# Altium schematic sheet Mikrokrmilnik, RF-detektor.SchDoc
size A4; CheckedBy: Nejc Klanjšček, Samo Penič; Author: Nejc Klanjšček; DrawnBy: Nejc Klanjšček; Engineer: Nejc Klanjšček; Organization: Fakulteta za elektrotehniko; Address1: https://github.com/nejcKlanjscek/SummerCampOfInnovativeTechnologies.git; Address2: nejc.kla@gmail.com; Revision: 1.0; SheetNumber: 1; SheetTotal: 2; Project: Poletni tabor inovativnih tehnologij 2021; License: MIT License
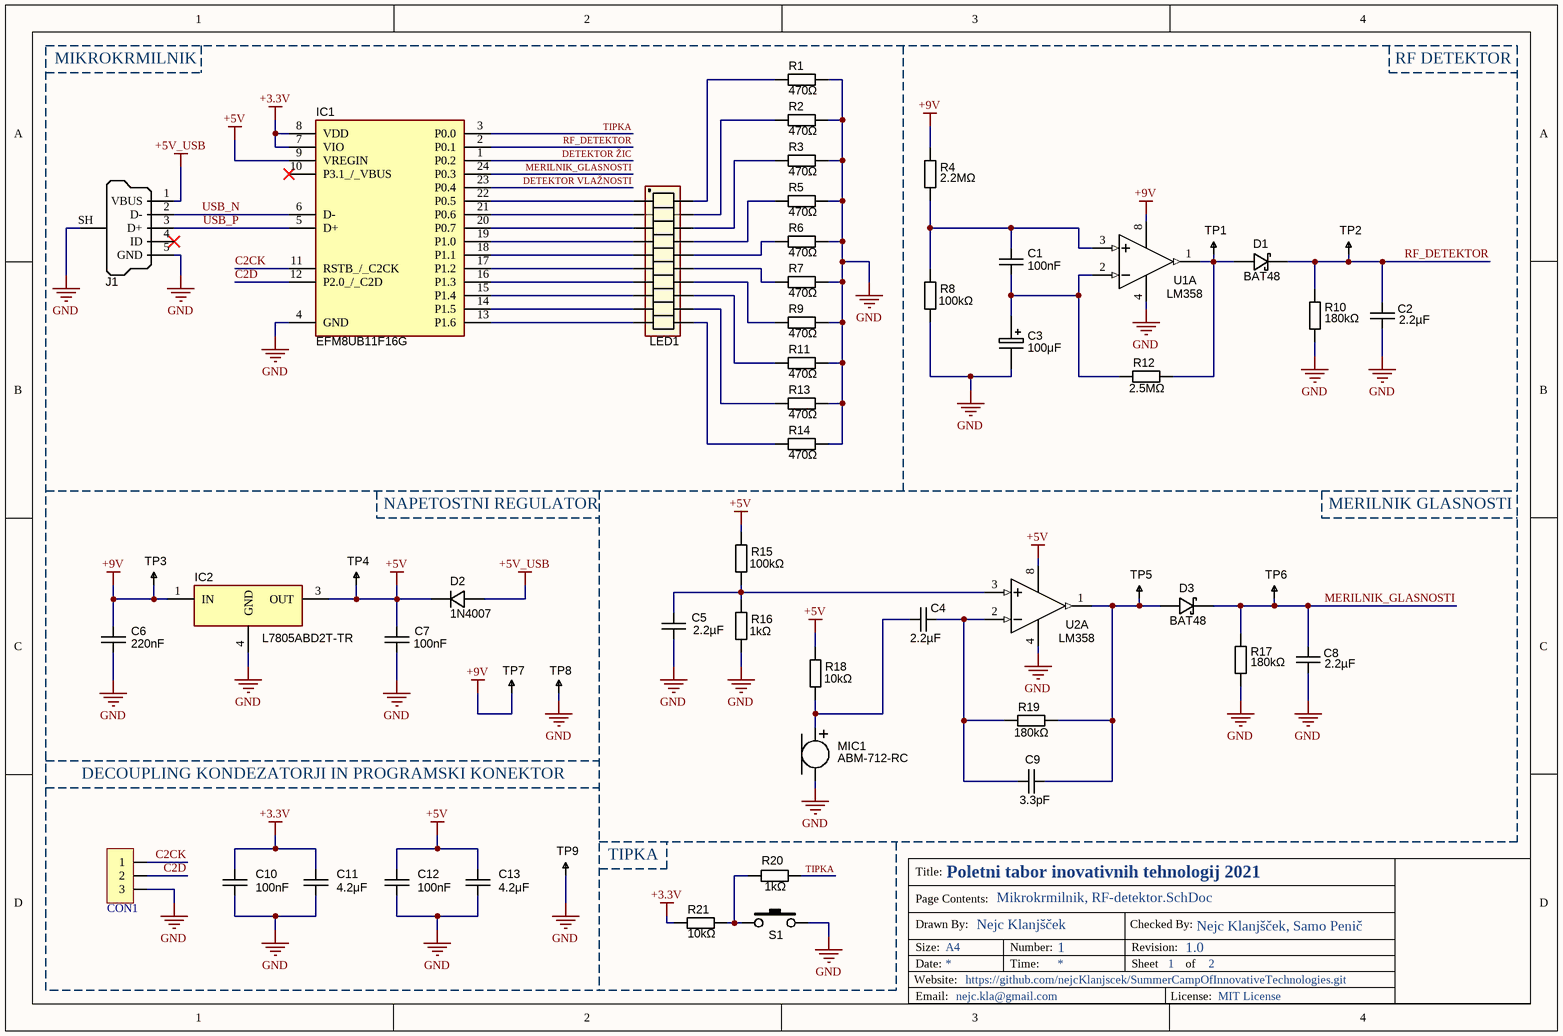
[diagram p0: Mikrokrmilnik, RF-detektor.SchDoc]

## Parts
C1  value 100nF  [B32520C0104J000]  (hidden comment: approved sub OK)
C2  2.2µF  [CAPC500P450250X550]
C3  100μF  [CAPE_5x11x2LS]
C4  2.2µF  [CAPC500P450250X550]
C5  2.2µF  [CAPC500P450250X550]
C6  value 220nF  [CAPC3216N]  (hidden comment: approved sub OK)
C7  value 100nF  [CAPC3216N]  (hidden comment: approved sub OK)
C8  2.2µF  [CAPC500P450250X550]
C9  3.3pF  [CAPC500P450250X550]
C10  value 100nF  [CAPC3216N]  (hidden comment: approved sub OK)
C11  value 4.2μF  [CAPC3216N]  (hidden comment: approved sub OK)
C12  value 100nF  [CAPC3216N]  (hidden comment: approved sub OK)
C13  value 4.2μF  [CAPC3216N]  (hidden comment: approved sub OK)
CON1  H1x3  [H1x3]  (value not drawn)
D1  BAT48  [do-35]
D2  1N4007  [DO-214AC]
D3  BAT48  [do-35]
IC1  EFM8UB11F16G  [SOP64P600X175-24N]
IC2  L7805ABD2T-TR  [D2PAK-STB35NF10T4]
J1  USB Micro Type B  [USB_Micro-B_FCI_SMD]  (value not drawn)
LED1  SSA-LXB10HW-GF  [SSA-LXB10HW-GF]  (value not drawn)
MIC1  ABM-712-RC  [ABM-707-RC]
R1  value 470Ω  [RESC3216N]  (hidden comment: Thick Film)
R2  value 470Ω  [RESC3216N]  (hidden comment: Thick Film)
R3  value 470Ω  [RESC3216N]  (hidden comment: Thick Film)
R4  value 2.2MΩ  [RESTH_AXIAL-1/8W]  (hidden comment: RES_NL_1/8W)  (no BOM)
R5  value 470Ω  [RESC3216N]  (hidden comment: Thick Film)
R6  value 470Ω  [RESC3216N]  (hidden comment: Thick Film)
R7  value 470Ω  [RESC3216N]  (hidden comment: Thick Film)
R8  value 100kΩ  [RESTH_AXIAL-1/8W]  (hidden comment: RES_NL_1/8W)  (no BOM)
R9  value 470Ω  [RESC3216N]  (hidden comment: Thick Film)
R10  value 180kΩ  [RESTH_AXIAL-1/8W]  (hidden comment: RES_NL_1/8W)  (no BOM)
R11  value 470Ω  [RESC3216N]  (hidden comment: Thick Film)
R12  value 2.5MΩ  [RESTH_AXIAL-1/8W]  (hidden comment: RES_NL_1/8W)  (no BOM)
R13  value 470Ω  [RESC3216N]  (hidden comment: Thick Film)
R14  value 470Ω  [RESC3216N]  (hidden comment: Thick Film)
R15  value 100kΩ  [RESTH_AXIAL-1/8W]  (hidden comment: RES_NL_1/8W)  (no BOM)
R16  value 1kΩ  [RESTH_AXIAL-1/8W]  (hidden comment: RES_NL_1/8W)  (no BOM)
R17  value 180kΩ  [RESTH_AXIAL-1/8W]  (hidden comment: RES_NL_1/8W)  (no BOM)
R18  value 10kΩ  [RESTH_AXIAL-1/8W]  (hidden comment: RES_NL_1/8W)  (no BOM)
R19  value 180kΩ  [RESTH_AXIAL-1/8W]  (hidden comment: RES_NL_1/8W)  (no BOM)
R20  value 1kΩ  [RESC3216N]  (hidden comment: Thick Film)
R21  value 10kΩ  [RESC3216N]  (hidden comment: Thick Film)
S1  SW_THT_PB_7.0mm  [TACT-SWITCH-TS1170]  (value not drawn)
TP1  TESTPOINT  [TP-R60]  (value not drawn)  (no BOM)
TP2  TESTPOINT  [TP-R60]  (value not drawn)  (no BOM)
TP3  TESTPOINT  [TP-R60]  (value not drawn)  (no BOM)
TP4  TESTPOINT  [TP-R60]  (value not drawn)  (no BOM)
TP5  TESTPOINT  [TP-R60]  (value not drawn)  (no BOM)
TP6  TESTPOINT  [TP-R60]  (value not drawn)  (no BOM)
TP7  TESTPOINT_THT  [TP-THT-MULTI]  (value not drawn)
TP8  TESTPOINT_THT  [TP-THT-MULTI]  (value not drawn)
TP9  TESTPOINT  [TP-R60]  (value not drawn)  (no BOM)
U1  LM358  [DIP8-300]  (part A of 2)
U2  LM358  [DIP8-300]  (part A of 2)

## Nets
+3.3V: C10.1 C11.1 IC1.7(VIO) IC1.8(VDD) R21.1
+5V: C7.1 C12.1 C13.1 D2.K IC1.9(VREGIN) IC2.3(OUT) R15.1 R18.1 TP4.1 U2.8(V+)
+5V_USB: D2.A J1.1(VBUS)
+9V: C6.1 IC2.1(IN) R4.1 TP3.1 TP7.1 U1.8(V+)
GND: C2.2 C3.2 C5.1 C6.2 C7.2 C8.2 C10.2 C11.2 C12.2 C13.2 CON1.3 IC1.4(GND) IC2.4(GND) J1.5(GND) J1.SH(Shell) MIC1.2(-) R1.1 R2.1 R3.1 R5.1 R6.1 R7.1 R8.2 R9.1 R10.1 R11.1 R13.1 R14.1 R16.2 R17.1 S1.2 TP8.1 TP9.1 U1.4(V-) U2.4(V-)
C2CK: CON1.1 IC1.11(RSTB_/_C2CK)
C2D: CON1.2 IC1.12(P2.0_/_C2D)
DETEKTOR VLAŽNOSTI: IC1.23(P0.4)
DETEKTOR ŽIC: IC1.1(P0.2)
MERILNIK_GLASNOSTI: C8.1 D3.K IC1.24(P0.3) R17.2 TP6.1
RF_DETEKTOR: C2.1 D1.K IC1.2(P0.1) R10.2 TP2.1
TIPKA: IC1.3(P0.0) R20.1
USB_N: IC1.6(D-) J1.2(D-)
USB_P: IC1.5(D+) J1.3(D+)
NetC1_1: C1.1 R4.2 R8.1 U1.3(IN+)
NetC1_2: C1.2 C3.1 R12.1 U1.2(IN-)
NetC4_1: C4.1 MIC1.1(+) R18.2
NetC4_2: C4.2 C9.1 R19.2 U2.2(IN-)
NetC5_2: C5.2 R15.2 R16.1 U2.3(IN+)
NetC9_2: C9.2 D3.A R19.1 TP5.1 U2.1(OUT)
NetD1_A: D1.A R12.2 TP1.1 U1.1(OUT)
NetIC1_13: IC1.13(P1.6) LED1.10
NetIC1_14: IC1.14(P1.5) LED1.9
NetIC1_15: IC1.15(P1.4) LED1.8
NetIC1_16: IC1.16(P1.3) LED1.7
NetIC1_17: IC1.17(P1.2) LED1.6
NetIC1_18: IC1.18(P1.1) LED1.5
NetIC1_19: IC1.19(P1.0) LED1.4
NetIC1_20: IC1.20(P0.7) LED1.3
NetIC1_21: IC1.21(P0.6) LED1.2
NetIC1_22: IC1.22(P0.5) LED1.1
NetLED1_11: LED1.11 R14.2
NetLED1_12: LED1.12 R13.2
NetLED1_13: LED1.13 R11.2
NetLED1_14: LED1.14 R9.2
NetLED1_15: LED1.15 R7.2
NetLED1_16: LED1.16 R6.2
NetLED1_17: LED1.17 R5.2
NetLED1_18: LED1.18 R3.2
NetLED1_19: LED1.19 R2.2
NetLED1_20: LED1.20 R1.2
NetR20_2: R20.2 R21.2 S1.1

Not connected (* = marked no-connect by the designer): IC1 10(P3.1_/_VBUS)*; J1 4(ID)*

## Notes on the sheet
- MIKROKRMILNIK
- RF DETEKTOR
- NAPETOSTNI REGULATOR
- MERILNIK GLASNOSTI
- DECOUPLING KONDEZATORJI IN PROGRAMSKI KONEKTOR
- (near TP9) TIPKA
- Title:
- Page Contents:
- Website:
- Size:
- Date:
- Drawn By:
- Email:
- A4
- Number:
- Time:
- Checked By:
- Revision:
- Sheet
- License:
- of

## Library data of the parts
C1 = CAPC_220n_B32520: Capacitor THD Cer 100nF 10% 100V X7R B32520; Manufacturer 1: TDK Corporation; Manufacturer Part Number 1: C1608X7R1C224K; Ratings: 16V; X7R; Tolerance: ±10%; Package / Case: 0603 (1608 metric); Supplier 1: Digi-Key; Supplier Part Number 1: 445-1318-1-ND
C2 C4 C5 C8 C9 = CAPC_2u2_FG28_25V
C3 = CAPT_10u_5mm_63V
C6 = CAPC_10u_1206_10V: Capacitor SMD Cer 220nF 10% 10V X5R 1206; Manufacturer 1: KEMET; Manufacturer Part Number 1: C1206C106K8PACTU; Ratings: 10V; X5R; Material: ceramic; Package / Case: 1206 (3216 metric); Tolerance: ±10%; Supplier 1: Digi-Key; Supplier Part Number 1: C1206C106K8PACTU-ND
C7 C10 C12 = CAPC_10u_1206_10V: Capacitor SMD Cer 100nF 10% 10V X5R 1206; Manufacturer 1: KEMET; Manufacturer Part Number 1: C1206C106K8PACTU; Ratings: 10V; X5R; Material: ceramic; Package / Case: 1206 (3216 metric); Tolerance: ±10%; Supplier 1: Digi-Key; Supplier Part Number 1: C1206C106K8PACTU-ND
C11 C13 = CAPC_10u_1206_10V: Capacitor SMD Cer 4.2uF 10% 10V X5R 1206; Manufacturer 1: KEMET; Manufacturer Part Number 1: C1206C106K8PACTU; Ratings: 10V; X5R; Material: ceramic; Package / Case: 1206 (3216 metric); Tolerance: ±10%; Supplier 1: Digi-Key; Supplier Part Number 1: C1206C106K8PACTU-ND
CON1 = H1x3: Header 1x8 (male)
D1 D3 = DIODE_SCHOTTKY_BAT48: Diode Schottky SMD 40V 350mA DO-35; Manufacturer 1: Fairchild Semiconductor; Manufacturer Part Number 1: MBRS130L; Material: Si; Ratings: 30Vr; 2A; Package / Case: DO-214AA, SMB; Supplier 1: Digi-Key; Supplier Part Number 1: MBRS130LFSCT-ND
D2 = DIODE_1N4007_1000V_1.0A_DO-41: Diode 1N4007 1A 1000V THD; Manufacturer 1: Diodes Inc; Manufacturer Part Number 1: 1N4007-T; Ratings: 100V; 1.5A; Diode Type: Standard; Value: Vf = 1.15V @ 1.5A (Max); Package / Case: DO-41; Mounting Type: Through Hole
IC1 = EFM8UB11F16G-C-QSOP24: Integrated Circuit; Manufacturer_Name: Silicon Labs; Datasheet Link: http://www.mouser.com/ds/2/368/EFM8UB1_DataSheet-793165.pdf; Height: 1.75mm; Manufacturer_Part_Number: EFM8UB11F16G-C-QSOP24; Mouser Part Number: 634-8UB11F16GCQSOP24; Mouser Price/Stock: https://www.mouser.co.uk/ProductDetail/Silicon-Labs/EFM8UB11F16G-C-QSOP24?qs=h6RIvS%252BzmlfRbNYtg60NqQ%3D%3D; Arrow Part Number: EFM8UB11F16G-C-QSOP24; Arrow Price/Stock: https://www.arrow.com/en/products/efm8ub11f16g-c-qsop24/silicon-labs
IC2 = L7805ABD2T-TR: Integrated Circuit; Manufacturer_Name: STMicroelectronics; Datasheet Link: https://www.st.com/resource/en/datasheet/l78.pdf; Manufacturer_Part_Number: L7805ABD2T-TR; Mouser Part Number: 511-L7805ABD2T-TR; Mouser Price/Stock: https://www.mouser.co.uk/ProductDetail/STMicroelectronics/L7805ABD2T-TR?qs=LL%252BsqOK9SqOQ%2FfZD5ZsNqA%3D%3D; Arrow Part Number: L7805ABD2T-TR; Arrow Price/Stock: https://www.arrow.com/en/products/l7805abd2t-tr/stmicroelectronics
J1 = USB_Micro_TypeB_FCI: Connector SMD-THD USB Micro Type B middle mount; Manufacturer 1: FCI; Manufacturer Part Number 1: 10103593-0001LF; Package / Case: SMD/THD mid-mount; Supplier 1: Digi-Key; Supplier Part Number 1: 609-4049-1-ND
MIC1 = MICROPHONE_C_ABM-712-RC
R1-R3 R5-R7 R9 R11 R13 R14 = RES_51R_1206_1%: Resistor SMD chip 51 Ohm 0.25W 1% 1206; Manufacturer 1: Vishay/Dale; Manufacturer Part Number 1: CRCW120651R0JNEA; Ratings: 1/4W; Package / Case: 1206 (3216 metric); Supplier 1: Digi-Key; Supplier Part Number 1: 541-51ECT-ND; Tolerance: ±1%
R4 = RES_NL_1/8W: Resistor THD Axial 2.2MΩ 0.125W 1% Carbon Film; Manufacturer 1: Royal Ohm; Ratings: 1/10 W; Tolerance: ±5%; Package / Case: 2010 (5025 metric)
R8 R15 = RES_NL_1/8W: Resistor THD Axial 100kΩ 0.125W 1% Carbon Film; Manufacturer 1: Royal Ohm; Ratings: 1/10 W; Tolerance: ±5%; Package / Case: 2010 (5025 metric)
R10 R17 R19 = RES_NL_1/8W: Resistor THD Axial 180kΩ 0.125W 1% Carbon Film; Manufacturer 1: Royal Ohm; Ratings: 1/10 W; Tolerance: ±5%; Package / Case: 2010 (5025 metric)
R12 = RES_NL_1/8W: Resistor THD Axial 2.5MΩ 0.125W 1% Carbon Film; Manufacturer 1: Royal Ohm; Ratings: 1/10 W; Tolerance: ±5%; Package / Case: 2010 (5025 metric)
R16 R18 = RES_NL_1/8W: Resistor THD Axial 1kΩ 0.125W 1% Carbon Film; Manufacturer 1: Royal Ohm; Ratings: 1/10 W; Tolerance: ±5%; Package / Case: 2010 (5025 metric)
R20 = RES_51R_1206_1%: Resistor SMD chip 1k Ohm 0.25W 1% 1206; Manufacturer 1: Vishay/Dale; Manufacturer Part Number 1: CRCW120651R0JNEA; Ratings: 1/4W; Package / Case: 1206 (3216 metric); Supplier 1: Digi-Key; Supplier Part Number 1: 541-51ECT-ND; Tolerance: ±1%
R21 = RES_51R_1206_1%: Resistor SMD chip 10k Ohm 0.25W 1% 1206; Manufacturer 1: Vishay/Dale; Manufacturer Part Number 1: CRCW120651R0JNEA; Ratings: 1/4W; Package / Case: 1206 (3216 metric); Supplier 1: Digi-Key; Supplier Part Number 1: 541-51ECT-ND; Tolerance: ±1%
S1 = SW_THT_PB_7.0mm: Switch, tact, 7.0mm stem; Manufacturer 1: Bond-Tact; Manufacturer Part Number 1: TS-1170-WP-300; Function: On/Off; Package / Case: 6.5x6.5mm; 7.0mm stem; Material: Brass/Nylon/Ag plating
TP1-TP6 TP9 = TESTPOINT: SMD test pin
TP7 TP8 = TESTPOINT_THT: Test Point PCB mount Multi-purpose Yellow; Manufacturer 1: Keystone Electronics; Manufacturer Part Number 1: 5014; Description 1: TEST POINT PC MULTI PURPOSE YEL; Supplier 1: Digi-Key; Supplier Part Number 1: 5014K-ND; Mounting Type: 0.063" (1.600mm) Hole Diameter; Material: Base, Nylon 46, UL 94V-0
U1 U2 = IC_Op-Amp_LM358: IC THD Op Amp Precision Micropower SOIC-8; Manufacturer 1: Linear Technology; Manufacturer Part Number 1: LT1077IS8#PBF; Voltage - Supply: 2.2 V ~ 30 V, ±1.1 V ~ 15 V; Gain Bandwidth Product: 230kHz; Package / Case: 8-SOIC (0.154", 3.90mm Width); Supplier 1: Digi-Key; Supplier Part Number 1: LT1077IS8#PBF-ND